# EAGLE design NRF52_Metal_Detector_v1.0 (EAGLE 8.1.1)
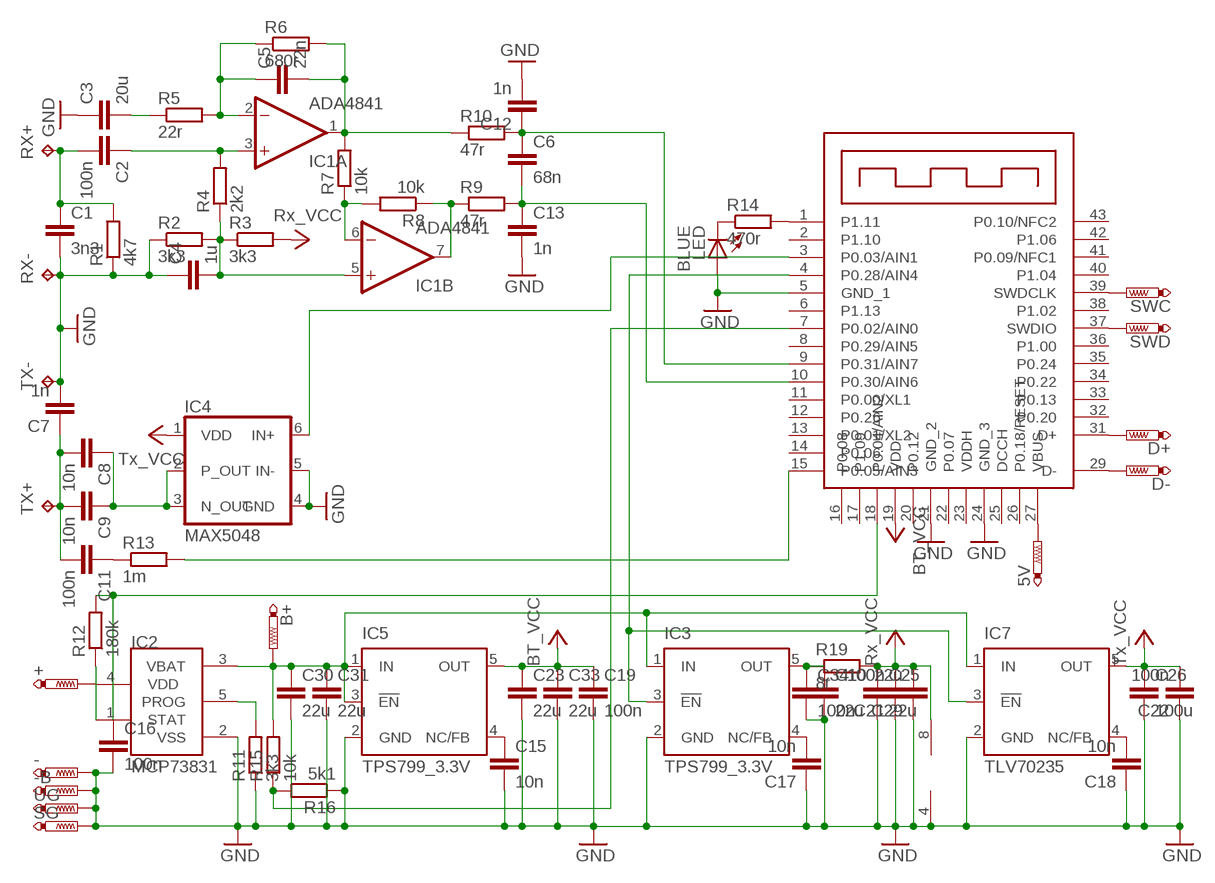
[diagram p0: schematic, sheet 1]

## Parts
5V  PTR1TP13SQ  [TP13SQ]
+  PTR1TP20SQ  [TP20SQ]
-  PTR1TP20SQ  [TP20SQ]
-B  PTR1TP20SQ  [TP20SQ]
B+  PTR1TP20SQ  [TP20SQ]
C1  3n3  C-EUC0805  [C0805]
C2  100n  C-EUC1206  [C1206]
C3  20u  C-EUC1206  [C1206]
C4  1u  C-EUC1206  [C1206]
C5  22n  C-EUC0805  [C0805]
C6  68n  C-EUC1206  [C1206]
C7  1n  C-EUC0805  [C0805]
C8  10n  C-EUC1206  [C1206]
C9  10n  C-EUC1206  [C1206]
C10  22u  C-EUC1206  [C1206]
C11  100n  C-EUC1206  [C1206]
C12  1n  C-EUC0805  [C0805]
C13  1n  C-EUC0805  [C0805]
C15  10n  C-EUC0805  [C0805]
C16  100n  C-EUC0805  [C0805]
C17  10n  C-EUC0805  [C0805]
C18  10n  C-EUC0805  [C0805]
C19  100n  C-EUC0805  [C0805]
C21  100n  C-EUC0805  [C0805]
C22  100n  C-EUC0805  [C0805]
C23  22u  C-EUC1206  [C1206]
C25  22u  C-EUC1206  [C1206]
C26  100u  C-EUC1206  [C1206]
C29  22u  C-EUC1206  [C1206]
C30  22u  C-EUC1206  [C1206]
C31  22u  C-EUC1206  [C1206]
C33  22u  C-EUC1206  [C1206]
C34  100n  C-EUC0805  [C0805]
D+  PTR1TP13SQ  [TP13SQ]
D-  PTR1TP13SQ  [TP13SQ]
E73-2G4M08S1C1  E73-2G4M08S1C  [E73-2G4M08S1C]
IC1  ADA4841  LM393D  [SO08]
IC2  MCP73831  [SOT23-5L]
IC3  TPS799_3.3V  TPS77001  [SOT23-DBV]
IC4  MAX5048  [SOT23-6]
IC5  TPS799_3.3V  TPS77001  [SOT23-DBV]
IC7  TLV70235  TPS77001  [SOT23-DBV]
LED  BLUE  LEDSML0805  [SML0805]
R1  4k7  R-EU_R0805  [R0805]
R2  3k3  R-EU_R0805  [R0805]
R3  3k3  R-EU_R0805  [R0805]
R4  2k2  R-EU_R0805  [R0805]
R5  22r  R-EU_R0805  [R0805]
R6  680r  R-EU_R0805  [R0805]
R7  10k  R-EU_R0805  [R0805]
R8  10k  R-EU_R0805  [R0805]
R9  47r  R-EU_R0805  [R0805]
R10  47r  R-EU_R0805  [R0805]
R11  3k3  R-EU_R0805  [R0805]
R12  180k  R-EU_R0805  [R0805]
R13  1m  R-EU_R0805  [R0805]
R14  470r  R-EU_R0805  [R0805]
R15  10k  R-EU_R0805  [R0805]
R16  5k1  R-EU_R0805  [R0805]
R19  8r  R-EU_R1206  [R1206]
RX+  TPPAD1-13  [P1-13]
RX-  TPPAD1-13  [P1-13]
SG  PTR1TP13SQ  [TP13SQ]
SWC  PTR1TP13SQ  [TP13SQ]
SWD  PTR1TP13SQ  [TP13SQ]
TX+  TPPAD1-13  [P1-13]
TX-  TPPAD1-13  [P1-13]
UG  PTR1TP13SQ  [TP13SQ]

## Nets
+3V3A1: C10.1 C34.1 IC3.5(OUT) R19.1
+3V3B: C19.1 C23.1 C33.1 E73-2G4M08S1C1.19(VDD) IC5.5(OUT) ; supply symbol labelled BT_VCC
+3V3T: C22.2 C26.1 IC4.1(VDD) IC7.5(OUT) ; supply symbol labelled Tx_VCC
GND: -.TP -B.TP C1.2 C3.1 C4.1 C7.2 C10.2 C12.2 C13.2 C15.2 C16.2 C17.1 C18.1 C19.2 C21.1 C22.1 C23.2 C25.2 C26.2 C29.1 C30.2 C31.2 C33.2 C34.2 E73-2G4M08S1C1.5(GND_1) E73-2G4M08S1C1.21(GND_2) E73-2G4M08S1C1.24(GND_3) IC1.4(P:V-) IC2.2(VSS) IC3.2(GND) IC4.4(GND) IC4.5(IN-) IC5.2(GND) IC7.2(GND) LED.A R1.1 R2.1 R11.1 R16.1 RX-.TP SG.TP TX-.TP UG.TP
N$1: C5.2 IC1.1(A:OUT) R6.2 R7.2 R10.1
N$2: C1.1 C2.2 R1.2 RX+.TP
N$3: B+.TP C30.1 C31.1 IC2.3(VBAT) IC3.1(IN) IC5.1(IN) IC5.3(!EN) IC7.1(IN) R15.2
N$4: C3.2 R5.1
N$5: C5.1 IC1.2(A:-IN) R5.2 R6.1
N$6: C7.1 C8.2 C9.2 C11.2 TX+.TP
N$7: E73-2G4M08S1C1.1(P1.11) R14.2
N$8: C2.1 IC1.3(A:+IN) R4.2
N$9: IC1.6(B:-IN) R7.1 R8.2
N$10: C17.2 IC3.4(NC/FB)
N$11: C15.1 IC5.4(NC/FB)
N$12: C6.2 C13.1 E73-2G4M08S1C1.10(P0.30/AIN6) R9.2
N$13: E73-2G4M08S1C1.39(SWDCLK) SWC.TP
N$14: E73-2G4M08S1C1.37(SWDIO) SWD.TP
N$15: +.TP IC2.4(VDD)
N$16: IC2.5(PROG) R11.2
N$17: E73-2G4M08S1C1.4(P0.28/AIN4) IC3.3(!EN) IC7.3(!EN)
N$18: C16.1 E73-2G4M08S1C1.18(P0.04/AIN2) R12.2
N$19: C18.2 IC7.4(NC/FB)
N$20: IC2.1(STAT) R12.1
N$21: C8.1 C9.1 IC4.2(P_OUT) IC4.3(N_OUT)
N$22: C11.1 R13.1
N$23: E73-2G4M08S1C1.15(P0.05/AIN3) R13.2
N$25: LED.C R14.1
N$26: E73-2G4M08S1C1.7(P0.02/AIN0) R15.1 R16.2
N$27: C6.1 C12.1 E73-2G4M08S1C1.9(P0.31/AIN7) R10.2
N$28: E73-2G4M08S1C1.3(P0.03/AIN1) IC4.6(IN+)
N$29: D+.TP E73-2G4M08S1C1.31(D+)
N$30: D-.TP E73-2G4M08S1C1.29(D-)
N$31: IC1.7(B:OUT) R8.1 R9.1
N$32: 5V.TP E73-2G4M08S1C1.27(VBUS)
N$35: C4.2 IC1.5(B:+IN) R2.2 R3.1 R4.1
RX_VCC: C21.2 C25.1 C29.2 IC1.8(P:V+) R3.2 R19.2 ; supply symbol labelled Rx_VCC
Unconnected: E73-2G4M08S1C1.2(P1.10) E73-2G4M08S1C1.6(P1.13) E73-2G4M08S1C1.8(P0.29/AIN5) E73-2G4M08S1C1.11(P0.00/XL1) E73-2G4M08S1C1.12(P0.26) E73-2G4M08S1C1.13(P0.01/XL2) E73-2G4M08S1C1.14(P0.06) E73-2G4M08S1C1.16(P0.08) E73-2G4M08S1C1.17(P1.09) E73-2G4M08S1C1.20(P0.12) E73-2G4M08S1C1.22(P0.07) E73-2G4M08S1C1.23(VDDH) E73-2G4M08S1C1.25(DCCH) E73-2G4M08S1C1.26(P0.18/RESET) E73-2G4M08S1C1.32(P0.20) E73-2G4M08S1C1.33(P0.13) E73-2G4M08S1C1.34(P0.22) E73-2G4M08S1C1.35(P0.24) E73-2G4M08S1C1.36(P1.00) E73-2G4M08S1C1.38(P1.02) E73-2G4M08S1C1.40(P1.04) E73-2G4M08S1C1.41(P0.09/NFC1) E73-2G4M08S1C1.42(P1.06) E73-2G4M08S1C1.43(P0.10/NFC2)

## Library data of the parts
5V + - -B B+ D+ D- SG SWC SWD UG = testpad:PTR1: TEST PIN
C1-C13 C15-C19 C21-C23 C25 C26 C29-C31 C33 C34 = resistor:C-EU: CAPACITOR, European symbol
E73-2G4M08S1C1 = E73-2G4M08S1C:E73-2G4M08S1C
IC1 = linear:LM393: COMPARATOR
IC2 = mcp73831:MCP73831: Miniature Single-Cell, Fully Integrated Li-Ion, Li-Polymer Charge Management Controllers
IC3 IC5 IC7 = texas:TPS770*: ULTRALOW-POWER 50-mA LOW-DROPOUT LINEAR REGULATORS 50-mA Low-Dropout Regulator Source: http://focus.ti.com/lit/ds/symlink/tps77001.pdf; MF: TEXAS INSTRUMENTS; MPN: TPS77001DBVT; OC_FARNELL: 8461554; OC_NEWARK: 77C1171
IC4 = MAX5048:MAX5048: Driver
LED = led:LED: LED OSRAM: - CHIPLED LG R971, LG N971, LY N971, LG Q971, LY Q971, LO R971, LY R971 LH N974, LH R974 LS Q976, LO Q976, LY Q976 LO Q996 - Hyper CHIPLED LW Q18S LB Q993, LB Q99A, LB R99A - SideLED LS A670, LO A670, LY A670, LG A670, LP A670 LB A673, LV A673, LT A673, LW A673 LH A674 LY A675 LS A676, LA A676, LO A676, LY A676, LW A676 LS A679, LY A679, LG A679 - Hyper Micro SIDELED® LS Y876, LA Y876, LO Y876, LY Y876 LT Y87S - SmartLED LW L88C, LW L88S LB L89C, LB L89S, LG L890 LS L89K, LO L89K, LY L89K LS L896, LA L896, LO L896, LY L896 - TOPLED LS T670, LO T670, LY T670, LG T670, LP T670 LSG T670, LSP T670, LSY T670, LOP T670, LYG T670 LG T671, LOG T671, LSG T671 LB T673, LV T673, LT T673, LW T673 LH T674 LS T676, LA T676, LO T676, LY T676, LB T676, LH T676, LSB T676, LW T676 LB T67C, LV T67C, LT T67C, LS T67K, LO T67K, LY T67K, LW E67C LS E67B, LA E67B, LO E67B, LY E67B, LB E67C, LV E67C, LT E67C LW T67C LS T679, LY T679, LG T679 LS T770, LO T770, LY T770, LG T770, LP T770 LB T773, LV T773, LT T773, LW T773 LH T774 LS E675, LA E675, LY E675, LS T675 LS T776, LA T776, LO T776, LY T776, LB T776 LHGB T686 LT T68C, LB T68C - Hyper Mini TOPLED® LB M676 - Mini TOPLED Santana® LG M470 LS M47K, LO M47K, LY M47K Source: http://www.osram.convergy.de LUXEON: - LUMILED® LXK2-PW12-R00, LXK2-PW12-S00, LXK2-PW14-U00, LXK2-PW14-V00 LXK2-PM12-R00, LXK2-PM12-S00, LXK2-PM14-U00 LXK2-PE12-Q00, LXK2-PE12-R00, LXK2-PE12-S00, LXK2-PE14-T00, LXK2-PE14-U00 LXK2-PB12-K00, LXK2-PB12-L00, LXK2-PB12-M00, LXK2-PB14-N00, LXK2-PB14-P00, LXK2-PB14-Q00 LXK2-PR12-L00, LXK2-PR12-M00, LXK2-PR14-Q00, LXK2-PR14-R00 LXK2-PD12-Q00, LXK2-PD12-R00, LXK2-PD12-S00 LXK2-PH12-R00, LXK2-PH12-S00 LXK2-PL12-P00, LXK2-PL12-Q00, LXK2-PL12-R00 Source: www.luxeon.com KINGBRIGHT: KA-3528ASYC Source: www.kingbright.com
R1-R16 R19 = resistor:R-EU_: RESISTOR, European symbol
RX+ RX- TX+ TX- = testpad:TP: Test pad

## Board
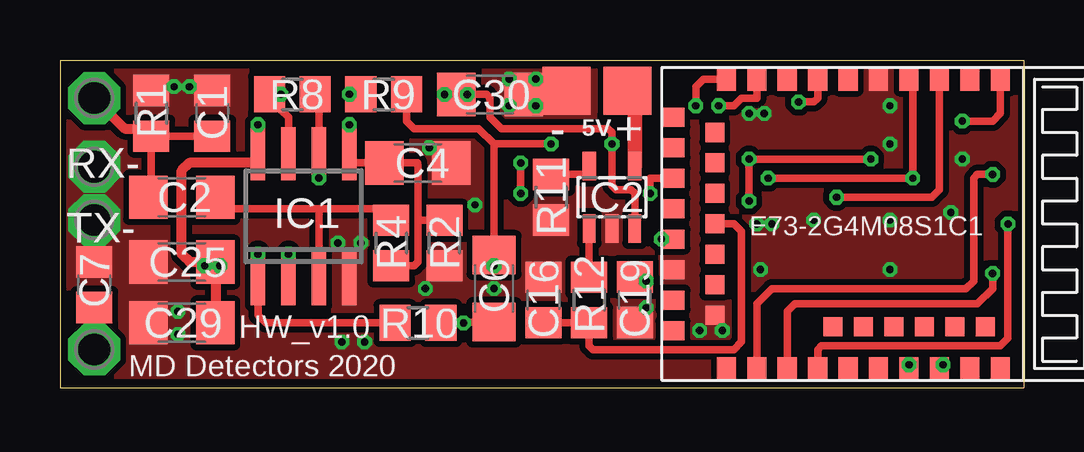
[diagram p1: board, top side]
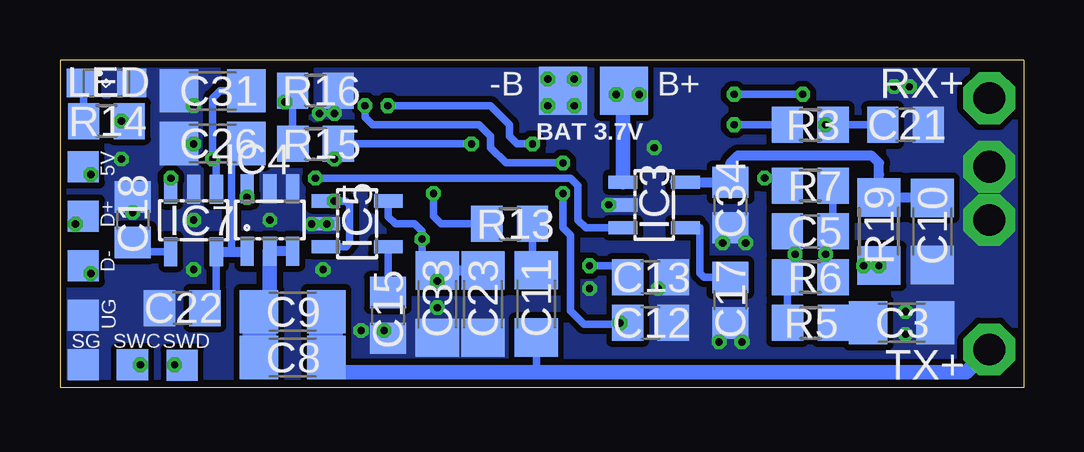
[diagram p2: board, bottom side, seen from below]

Size 40.17 x 13.65 mm. Coordinates in mm from the lower left corner, seen from the top.
Outline: 0,0 40.17,0 40.17,13.65 0,13.65 0,0
Copper layers (1*16): Top 0.035mm / dielectric 1.5mm / Bottom 0.035mm
Design rules "ITEADstudio_DRC": minimum track width 6mil, minimum drill 12mil, track to track 6mil, track to pad 6mil, pad to pad 6mil, via to via 6mil, smd to smd 0mil, copper to edge 10mil, drill to drill 10mil, minimum pad ring 10mil, minimum via ring 6mil, stop-mask expansion 2mil, vias tented up to drill 100mil, thermal gap 10mil

### Footprints (pad centres in the part's own frame; a part is rotated, then mirrored left to right if it is on the bottom)
TP13SQ = smd 1.3 x 1.3: TP 0,0
TP20SQ = smd 2 x 2: TP 0,0
C0805 = smd 1.3 x 1.5: 1 -0.95,0; 2 0.95,0
C1206 = smd 1.6 x 1.8: 1 -1.4,0; 2 1.4,0
E73-2G4M08S1C = smd 0.965 x 0.794: 1 0.476,14.129; 2 0.476,12.859; 3 0.476,11.589; 4 0.476,10.319; 5 0.476,9.049; 6 0.476,7.779; 7 0.476,6.509; 8 0.476,5.239; 9 0.476,3.969; 10 0.476,2.699; 26 12.541,2.699; 27 12.541,3.969; 29 12.541,5.239; 31 12.541,6.509; 33 12.541,7.779; 35 12.541,9.049; 37 12.541,10.319; 39 12.541,11.589; 41 12.541,12.859; 43 12.541,14.129 | smd 0.794 x 0.965: 11 2.064,0.476; 13 3.334,0.476; 15 4.604,0.476; 17 5.874,0.476; 19 7.144,0.476; 21 8.414,0.476; 23 9.684,0.476; 25 10.954,0.476 | smd 0.794 x 0.794: 12 2.699,2.223; 14 3.969,2.223; 16 5.239,2.223; 18 6.509,2.223; 20 7.779,2.223; 22 9.049,2.223; 24 10.319,2.223; 32 10.795,7.144; 34 10.795,8.414; 36 10.795,9.684; 38 10.795,10.954; 40 10.795,12.224; 42 10.795,13.494
SO08 = smd 0.6 x 2.2: 1 -1.905,-2.6; 2 -0.635,-2.6; 3 0.635,-2.6; 4 1.905,-2.6; 5 1.905,2.6; 6 0.635,2.6; 7 -0.635,2.6; 8 -1.905,2.6
SOT23-5L = smd 0.533 x 1.2: 1 -0.95,-1.3; 2 0,-1.3; 3 0.95,-1.3 | smd 0.55 x 1.2: 4 0.95,1.3; 5 -0.95,1.3
SOT23-DBV = smd 0.55 x 1.2: 1 -0.95,-1.3; 2 0,-1.3; 3 0.95,-1.3; 4 0.95,1.3; 5 -0.95,1.3
SOT23-6 = smd 0.55 x 1.2: 1 -0.95,-1.3; 2 0,-1.3; 3 0.95,-1.3; 4 0.95,1.3; 5 0.003,1.3; 6 -0.95,1.3
SML0805 = smd 1.2 x 1.2: A 1.05,0; C -1.05,0
R0805 = smd 1.3 x 1.5: 1 -0.95,0; 2 0.95,0
R1206 = smd 1.6 x 1.803: 1 -1.422,0; 2 1.422,0
P1-13 = drill 1.321 pad 2.159 octagon: TP 0,0

### Placement (x,y rotation side)
5V  39.2,9.2 0 bottom
+  23.65,12.38 0 top
-  21.11,12.38 0 top
-B  19.2,12.38 0 bottom
B+  16.66,12.38 0 bottom
C1  6.35,11.43 90 top
C2  5.08,7.94 180 top
C3  5.08,2.7 180 bottom
C4  14.91,9.36 180 top
C5  8.89,6.51 0 bottom
C6  18.1,4.13 90 top
C7  1.43,4.29 90 top
C8  30.47,1.26 0 bottom
C9  30.47,3.16 0 bottom
C10  3.81,6.51 270 bottom
C11  20.31,3.49 270 bottom
C12  15.55,2.7 0 bottom
C13  15.55,4.6 0 bottom
C15  26.49,3.01 270 bottom
C16  20.15,3.65 90 top
C17  12.22,3.64 90 bottom
C18  37.13,7 270 bottom
C19  23.96,3.66 270 top
C21  4.92,10.95 180 bottom
C22  35.08,3.32 0 bottom
C23  22.54,3.48 270 bottom
C25  5.08,5.24 180 top
C26  33.8,10.17 180 bottom
C29  5.08,2.7 0 top
C30  17.93,12.22 0 top
C31  33.81,12.37 180 bottom
C33  24.44,3.48 270 bottom
C34  12.22,7.61 270 bottom
D+  39.2,7.14 0 bottom
D-  39.2,5.08 0 bottom
E73-2G4M08S1C1  25.07,13.33 270 top
IC1  10.16,7.14 0 top
IC2  23.01,7.93 0 top
IC3  15.4,7.61 270 bottom
IC4  31.42,6.98 0 bottom
IC5  27.78,6.83 270 bottom
IC7  34.6,6.97 180 bottom
LED  38.23,12.69 0 bottom
R1  3.81,11.43 270 top
R2  16.02,6.03 90 top
R3  8.89,10.95 0 bottom
R4  13.8,6.03 90 top
R5  8.88,2.7 180 bottom
R6  8.89,4.6 0 bottom
R7  8.89,8.41 0 bottom
R8  9.68,12.22 0 top
R9  13.49,12.22 0 top
R10  14.92,2.7 0 top
R11  20.47,7.93 90 top
R12  22.06,3.65 270 top
R13  21.42,6.82 180 bottom
R14  38.23,11.11 0 bottom
R15  29.51,10.16 0 bottom
R16  29.53,12.38 180 bottom
R19  6.03,6.51 270 bottom
RX+  1.43,12.06 0 top
RX-  1.43,6.98 0 top
SG  39.2,0.95 0 bottom
SWC  37.15,0.95 0 bottom
SWD  35.07,0.94 90 bottom
TX+  1.43,1.59 0 top
TX-  1.43,9.21 0 top
UG  39.2,3.02 0 bottom

### Tracks (layer width: path | path; a pad name or v marks a point on that pad's centre or on a via)
+3V3A1
  Bottom 0.305: 6.03,9.2 6.03,8.89 | 14.6,8.57 14.41,8.6 IC3.5 14.44,8.53
  Bottom 0.406: C10.1 6,7.91 R19.1 6.03,8.89 6.03,9.36 6.35,9.68 11.9,9.68 12.22,9.36 C34.1 IC3.5
+3V3B  (via drill 0.3)
  Top 0.305: E73-2G4M08S1C1.19 | E73-2G4M08S1C1.19 | E73-2G4M08S1C1.19 v25.07,6.19 | C19.1 v24.44,4.44
  Bottom 0.305: IC5.5 26.48,7.12 26.19,6.82 25.39,6.82 25.07,6.51 v25.07,6.19 25.07,5.55 | C33.1 v24.44,4.44
  Bottom 0.406: C23.1 C33.1 | 24.44,5.04 C33.1 | C33.1 24.56,5.04 25.07,5.55
+3V3T
  Bottom 0.305: IC7.5 33.65,3.63 C22.2 | 32.37,5.67 IC4.1 | C26.1 33.01,9.56 33.01,5.67
  Bottom 0.406: IC7.5 33.01,5.67 32.37,5.67
GND  (via drill 0.3, 0.3 pad 0.25)
  other vias: 4.76,12.54 4.92,3.17 4.92,2.22 5.4,12.54 15.39,10 18.73,12.85 18.73,11.74 19.84,12.85 19.84,11.74 26.66,2.38 29.68,6.82 34.6,6.98 34.6,10.16 34.6,11.74 15.24,4.13 24.44,3.33 29.36,11.43 34.6,4.92 29.2,4.92 37.14,7.3 27.61,2.38 11.59,6.03 12.54,6.03 28.72,11.43 37.61,9.52 29.04,6.82 17.3,7.62 18.09,4.13 31.42,6.98 12.7,1.9 11.74,1.9
  pour Top (isolate 0.254, no thermals): 0.32,13.18 40.01,13.18 40.01,0.48 0.32,0.48
  pour Bottom (isolate 0.254, no thermals): 0.32,13.18 40.01,13.18 40.01,0.48 0.32,0.48
N$1  (via drill 0.3)
  Top 0.152: IC1.1 v8.26,5.56
  Top 0.305: R10.1 8.57,2.7 8.26,3.02 IC1.1
  Bottom 0.305: R7.2 C5.2 8.26,6.51 v8.26,5.56 8.26,5.24 R6.2
N$2
  Top 0.305: C2.2 3.81,8.23 R1.2 C1.1
  Top 0.406: RX+.TP 2.7,10.79 3.33,10.79 3.49,10.64 R1.2
N$3  (via drill 0.3)
  Top 0.152: C30.1 17.29,12.22 v16.98,12.22
  Top 0.305: IC2.3 23.96,8.1 23.8,8.25 23.17,8.25 23.01,8.41 v23.01,10.16 23.01,10.63 22.85,10.79 18.41,10.79 17.93,11.27 17.93,12.06 17.77,12.22 v16.98,12.22 | v28.73,7.78 v28.73,9.52 v33.8,9.52 | C30.1 v16.03,12.22
  Bottom 0.305: IC5.3 28.92,5.87 28.25,5.87 28.09,6.03 28.09,7.62 28.25,7.78 IC5.1 28.73,7.62 v28.73,7.78 | v28.73,9.52 28.56,9.69 R15.2 v23.01,10.16 | v16.98,12.22 B+.TP | 33.65,9.52 v33.8,9.52 | v33.8,9.52 33.8,12.06 33.49,12.38 32.26,12.38 C31.1 | v33.8,9.52 33.65,9.37 IC7.1
  Bottom 0.61: IC3.1 16.7,12.03 v16.98,12.22
N$4
  Bottom 0.305: C3.2 R5.1
N$5  (via drill 0.3)
  Top 0.152: IC1.2 v9.53,5.56
  Bottom 0.305: C5.1 9.52,6.19 v9.53,5.56 9.52,4.92 R6.1 R5.2
N$6
  Top 0.61: TX+.TP C7.1
  Bottom 0.305: C11.2 20.31,0.64
  Bottom 0.61: TX+.TP | TX+.TP 2.38,0.64 20.31,0.64 29.03,0.64 C8.2
  Bottom 1.422: C8.2 C9.2
N$7  (via drill 0.3)
  Top 0.305: E73-2G4M08S1C1.1 39.2,11.43 38.88,11.11 v37.61,11.11
  Bottom 0.305: R14.2 37.77,11.11 v37.61,11.11
N$8
  Top 0.305: IC1.3 10.79,7.46 | C2.1 6.67,8.1 7.14,7.46 10.79,7.46 | 10.79,7.46 13.8,7.46 R4.2
N$9  (via drill 0.3)
  Top 0.305: R8.2 10.79,12.23 IC1.6 v10.79,8.73 | v10.79,8.73 10.79,8.67 10.86,8.73 v10.79,8.73
  Bottom 0.305: R7.1 9.84,8.73 v10.79,8.73
N$10
  Bottom 0.305: C17.2 12.23,4.6 13.33,4.6 13.49,4.76 13.49,6.66 IC3.4
N$11
  Bottom 0.305: C15.1 26.49,5.72 IC5.4
N$12  (via drill 0.3)
  Top 0.305: 14.61,12.22 R9.2 | 14.6,12.22 R9.2 | R9.2 14.44,11.11 14.76,10.79 17.46,10.79 18.09,10.16 | v18.09,5.08 18.57,5.55 C6.2 18.09,10.16 | E73-2G4M08S1C1.10 26.82,12.86 26.5,12.54 v26.5,11.74 | 18.09,10.16 v20.47,10.16
  Bottom 0.305: C13.1 16.82,5.08 v18.09,5.08 | v20.47,10.16 21.11,10.16 21.42,10.47 21.42,10.95 22.22,11.74 v26.5,11.74
N$13  (via drill 0.3)
  Top 0.305: E73-2G4M08S1C1.39 36.66,0.64 v36.82,0.95
  Bottom 0.305: SWC.TP 36.98,0.95 v36.82,0.95
N$14  (via drill 0.3)
  Top 0.305: E73-2G4M08S1C1.37 v35.39,0.95
  Bottom 0.305: SWD.TP 34.93,0.94 v35.39,0.95
N$15
  Top 0.406: +.TP 23.8,12.06
  Top 0.61: IC2.4 23.96,12.38 +.TP
N$16
  Top 0.305: R11.2 21.9,8.88 IC2.5
N$17  (via drill 0.3)
  Top 0.305: v29.52,8.73 v35.55,8.73 35.55,12.7 E73-2G4M08S1C1.4
  Bottom 0.305: 17.3,6.67 17.01,6.63 IC3.3 17.02,6.67 18.25,6.67 18.57,6.98 18.57,8.41 18.89,8.73 v29.52,8.73 | IC7.3 v35.55,8.73
N$18
  Top 0.305: E73-2G4M08S1C1.18 27.46,6.82 28.09,6.82 28.41,6.51 28.41,1.9 28.09,1.59 22.22,1.59 22.06,1.75 R12.2 C16.1
N$19
  Bottom 0.305: 35.55,5.73 IC7.4 36.91,5.67 C18.2
N$20
  Top 0.305: 22.06,6.32 IC2.1 22.06,4.76 R12.1
N$21
  Bottom 0.406: IC4.3 IC4.2 | 31.42,3.61 C9.1
  Bottom 0.61: IC4.2 31.42,3.61
  Bottom 1.422: C9.1 C8.1
N$22
  Bottom 0.305: R13.1 20.47,5.05 C11.1
N$23  (via drill 0.3)
  Top 0.305: E73-2G4M08S1C1.15 24.6,8.73 v24.6,8.09
  Bottom 0.305: R13.2 24.28,6.82 24.6,7.14 v24.6,8.09
N$25
  Bottom 0.305: R14.1 39.18,12.59 LED.C
N$26  (via drill 0.3)
  Top 0.305: E73-2G4M08S1C1.7 31.58,12.06 31.42,11.9 v30.79,11.9
  Bottom 0.305: R15.1 30.46,12.21 R16.2 30.48,12.06 v30.79,11.9
N$27  (via drill 0.3)
  Top 0.305: 18.54,2.22 C6.1 | C6.1 18.54,2.25 | C6.1 16.85,2.73 v16.82,2.7 15.71,2.7 R10.2 | E73-2G4M08S1C1.9 29.04,12.06 28.41,12.06 28.09,11.74 v27.45,11.74 | v19.2,9.36 v19.2,8.09
  Bottom 0.305: C12.1 v16.82,2.7 16.88,2.64 18.32,2.64 18.89,3.21 18.89,6.35 19.2,6.67 v19.2,8.09 | v27.45,11.74 27.45,11.27 27.14,10.95 22.69,10.95 22.22,10.47 22.22,10 21.58,9.36 v19.2,9.36
N$28  (via drill 0.3)
  Top 0.305: v32.38,7.93 36.34,7.93 36.66,8.25 E73-2G4M08S1C1.3
  Bottom 0.305: IC4.6 v32.37,7.94 v32.38,7.93
N$29  (via drill 0.3)
  Top 0.305: E73-2G4M08S1C1.31 31.58,1.59 31.74,1.75 39.2,1.75 39.52,2.06 v39.52,6.82
  Bottom 0.305: D+.TP v39.52,6.82
N$30  (via drill 0.3)
  Top 0.305: E73-2G4M08S1C1.29 30.31,3.18 30.63,3.49 38.25,3.49 38.88,4.13 v38.88,4.76
  Bottom 0.305: D-.TP v38.88,4.76
N$31  (via drill 0.3)
  Top 0.305: v9.21,12.22 v9.21,12.23 R8.1 v9.21,12.22 | R9.1 v12.06,12.22 | IC1.7 9.53,11.27 9.21,11.59 v9.21,12.22
  Bottom 0.305: v9.21,12.22 v12.06,12.22
N$32  (via drill 0.3)
  Top 0.305: E73-2G4M08S1C1.27 29.04,3.49 29.68,4.13 37.77,4.13 38.09,4.44 38.09,8.73 38.25,8.89 v38.88,8.89
  Bottom 0.305: 5V.TP v38.88,8.89
N$35  (via drill 0.3)
  Top 0.305: IC1.5 12.06,9.52 | IC1.5 v12.06,10.95 | R4.1 | R4.1 14.76,5.08 14.92,5.24 14.92,6.98 | 14.92,6.98 14.92,9.21 14.92,9.36 C4.2 12.06,9.36 IC1.5 | R2.2 14.92,6.98
  Bottom 0.305: R3.1 v12.06,10.95
RX_VCC  (via drill 0.3)
  Top 0.152: C25.1 6.67,5.58
  Top 0.305: 8.26,10.32 IC1.8 | 8.26,9.68 IC1.8 | C25.1 6.67,5.24 v6.67,5.08 | IC1.8 v8.26,10.95
  Top 0.406: C25.1 5.4,5.24 5.08,5.56 5.08,9.05 5.4,9.37 8.26,9.37 8.26,9.68 | 6.35,5.56 C25.1 | C25.1 C29.2 | C25.1 6.03,5.24 v6.03,5.08
  Bottom 0.305: v8.26,10.95 8.09,10.95 | 8.09,10.95 R3.2 C21.2 | 8.09,10.95 v8.25,10.95 7.62,10.95
  Bottom 0.406: R19.2 6.03,4.61 v6.03,5.08

### Text on the board
tNames: 5V | E73-2G4M08S1C1 | HW_v1.0 | MD Detectors 2020
bNames: BAT 3.7V